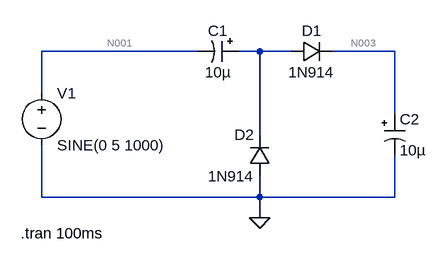
[diagram p0: schematic sim3shema.asc]
sim3shema.asc, the LTspice schematic file:
Version 4
SHEET 1 880 680
WIRE 144 96 -96 96
WIRE 240 96 208 96
WIRE 288 96 240 96
WIRE 448 96 352 96
WIRE -96 160 -96 96
WIRE 448 192 448 96
WIRE 240 224 240 96
WIRE -96 320 -96 240
WIRE 240 320 240 288
WIRE 240 320 -96 320
WIRE 448 320 448 256
WIRE 448 320 240 320
WIRE 240 352 240 320
FLAG 240 352 0
SYMBOL polcap 208 80 R90
WINDOW 0 0 32 VBottom 2
WINDOW 3 32 32 VTop 2
SYMATTR InstName C1
SYMATTR Value 10µ
SYMATTR Description Capacitor
SYMATTR Type cap
SYMBOL diode 288 112 R270
WINDOW 0 32 32 VTop 2
WINDOW 3 0 32 VBottom 2
SYMATTR InstName D1
SYMATTR Value 1N914
SYMBOL diode 256 288 R180
WINDOW 0 24 64 Left 2
WINDOW 3 24 0 Left 2
SYMATTR InstName D2
SYMATTR Value 1N914
SYMBOL voltage -96 144 R0
WINDOW 123 0 0 Left 2
WINDOW 39 0 0 Left 2
SYMATTR InstName V1
SYMATTR Value SINE(0 5 1000)
SYMBOL polcap 432 192 R0
WINDOW 3 24 56 Left 2
SYMATTR Value 10µ
SYMATTR InstName C2
SYMATTR Description Capacitor
SYMATTR Type cap
TEXT -128 376 Left 2 !.tran 100ms

The netlist it stands for:
* sim3shema.asc
C1 N002 N001 10µ
D1 N002 N003 1N914
D2 0 N002 1N914
V1 N001 0 SINE(0 5 1000)
C2 N003 0 10µ
.model D D
.lib standard.dio
.tran 100ms
.backanno
.end

* Results of the author's LTspice run, read from the files saved beside the schematic
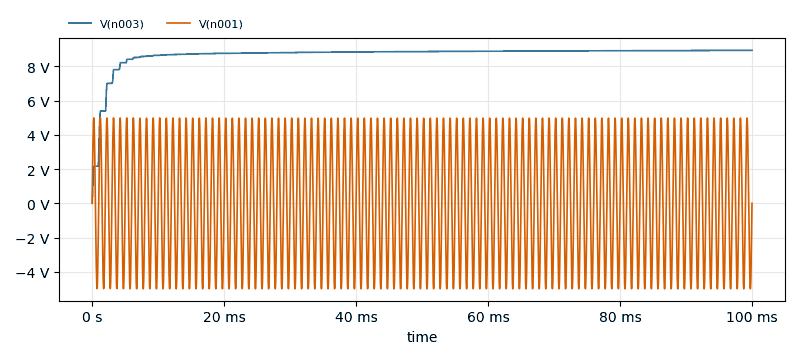
[diagram p1: Transient Analysis of sim3shema.asc, plotted from the saved traces]
* Transient Analysis, 1 run:
*   V(n003): min 0 V, max 8.937 V, average 8.696 V, rms 8.735 V, last 8.937 V
*   V(n001): min -4.998 V, max 4.99 V, average -16.21 mV, rms 3.539 V, last 0 V